# EAGLE design onion_dip_v1 (EAGLE 6.5.0)
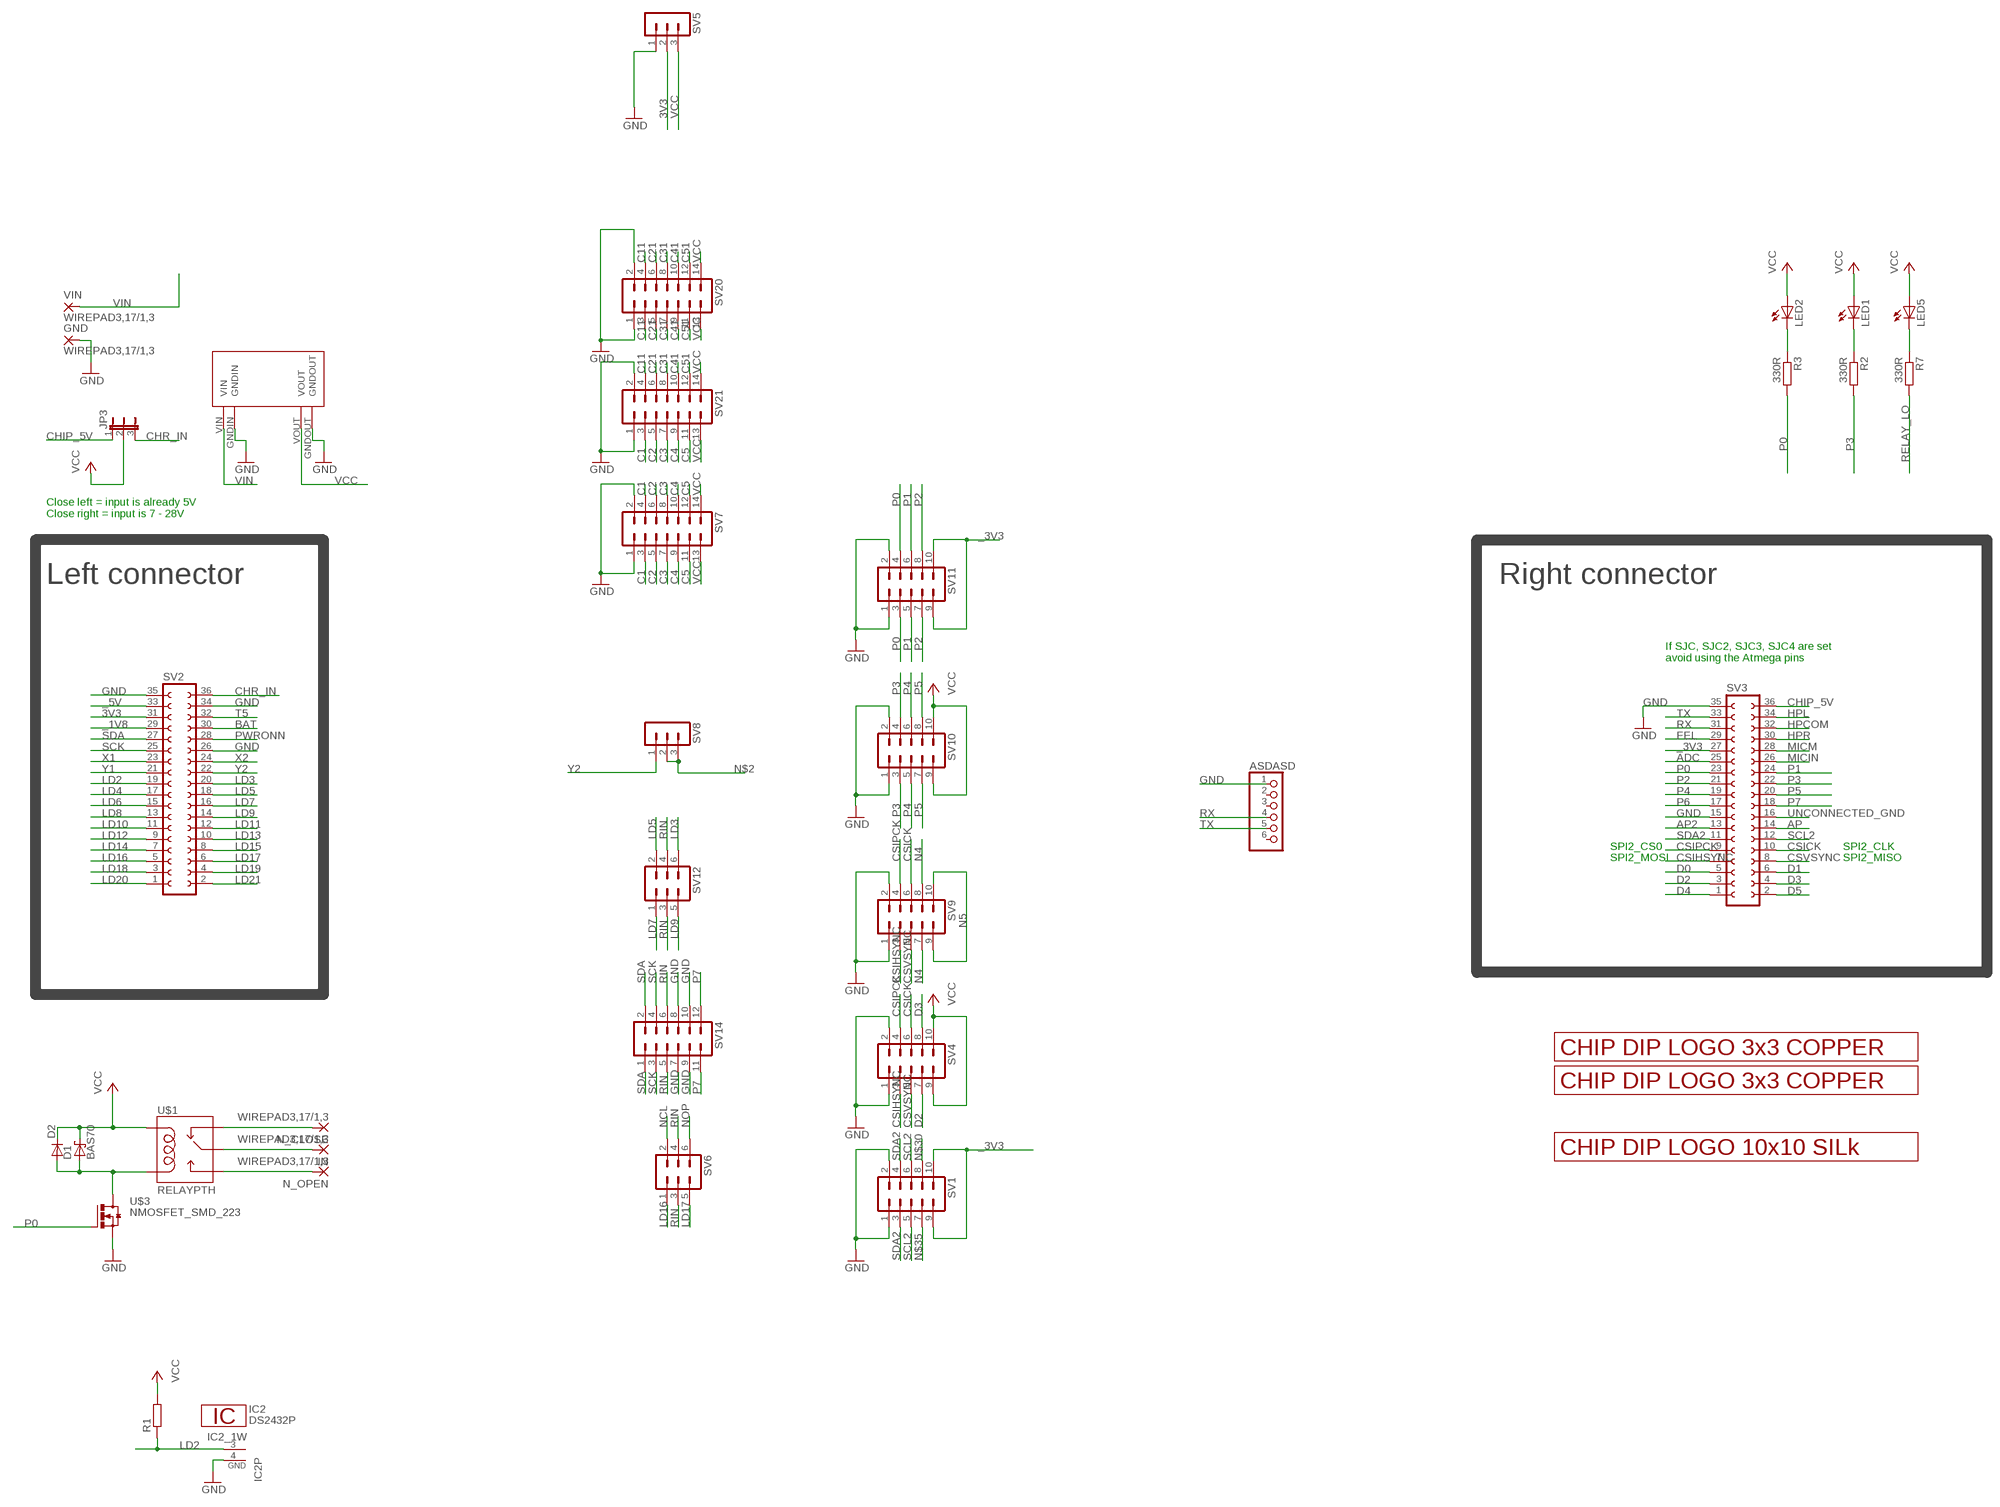
[diagram p0: schematic, sheet 1]

## Parts
ASDASD  PINHD-1X6  [1X06]
D1  BAS70  [SOT23]
D2  DIODE-SMB  [SMB]
GND  WIREPAD3,17/1,3  [3,17/1,3]
IC2  DS2432P  [TSOC6]
IN  WIREPAD3,17/1,3  [3,17/1,3]
JP3  JP2E  [JP2]
LED1  LEDCHIP-LED0805  [CHIP-LED0805]
LED2  LEDCHIP-LED0805  [CHIP-LED0805]
LED5  LEDCHIP-LED0805  [CHIP-LED0805]
N_CLOSE  WIREPAD3,17/1,3  [3,17/1,3]
N_OPEN  WIREPAD3,17/1,3  [3,17/1,3]
R1  R-EU_R0805  [R0805]
R2  330R  R-EU_R0805  [R0805]
R3  330R  R-EU_R0805  [R0805]
R7  330R  R-EU_R0805  [R0805]
SV1  MA05-2  [MA05-2]
SV2  FE18-2  [FE18-2]
SV3  FE18-2  [FE18-2]
SV4  MA05-2  [MA05-2]
SV5  MA03-1  [MA03-1]
SV6  MA03-2  [MA03-2]
SV7  MA07-2  [MA07-2]
SV8  MA03-1  [MA03-1]
SV9  MA05-2  [MA05-2]
SV10  MA05-2  [MA05-2]
SV11  MA05-2  [MA05-2]
SV12  MA03-2  [MA03-2]
SV14  MA06-2  [MA06-2]
SV20  MA07-2  [MA07-2]
SV21  MA07-2  [MA07-2]
U$1  RELAYPTH  [SRD-05VDC-SL-C]
U$3  NMOSFET_SMD_223  [SOT223]
U$4  LOGO_3X3_COPPER  [LOGO_3X3_COPPER]
U$5  LOGO_10X10_SILK  [LOGO_10X10_SILK]
U$6  LOGO_3X3_COPPER  [LOGO_3X3_COPPER]
U$9  MP1584EN_FRAMELESS  [MP1584EN_FRAMELESS]
VIN  WIREPAD3,17/1,3  [3,17/1,3]

## Nets
3V3: SV2.31 SV5.2
_1V8: SV2.29
_3V3: SV1.9 SV1.10 SV3.27 SV11.9 SV11.10
_5V: SV2.33
ADC: SV3.25
AP: SV3.14
AP2: SV3.13
BAT: SV2.30
C1: SV7.3 SV7.4 SV21.3
C2: SV7.5 SV7.6 SV21.5
C3: SV7.7 SV7.8 SV21.7
C4: SV7.9 SV7.10 SV21.9
C5: SV7.11 SV7.12 SV21.11
C11: SV20.3 SV20.4 SV21.4
C21: SV20.5 SV20.6 SV21.6
C31: SV20.7 SV20.8 SV21.8
C41: SV20.9 SV20.10 SV21.10
C51: SV20.11 SV20.12 SV21.12
CHIP_5V: JP3.1 SV3.36
CHR_IN: JP3.3 SV2.36
CSICK: SV3.10 SV4.6 SV9.6
CSIHSYNC: SV3.7 SV4.3 SV9.3
CSIPCK: SV3.9 SV4.4 SV9.4
CSVSYNC: SV3.8 SV4.5 SV9.5
D0: SV3.5
D1: SV3.6
D2: SV3.3 SV4.7
D3: SV3.4 SV4.8
D4: SV3.1
D5: SV3.2
FEL: SV3.29
GND: ASDASD.1 GND.1(P) IC2.4(GND) SV1.1 SV1.2 SV2.26 SV2.34 SV2.35 SV3.15 SV3.35 SV4.1 SV4.2 SV5.1 SV7.1 SV7.2 SV9.1 SV9.2 SV10.1 SV10.2 SV11.1 SV11.2 SV14.7 SV14.8 SV14.9 SV14.10 SV20.1 SV20.2 SV21.1 SV21.2 U$3.3(S) U$9.GNDIN U$9.GNDOUT
HPCOM: SV3.32
HPL: SV3.34
HPR: SV3.30
LD2: IC2.3(1W) R1.1 SV2.19
LD3: SV2.20 SV12.6
LD4: SV2.17
LD5: SV2.18 SV12.2
LD6: SV2.15
LD7: SV2.16 SV12.1
LD8: SV2.13
LD9: SV2.14 SV12.5
LD10: SV2.11
LD11: SV2.12
LD12: SV2.9
LD13: SV2.10
LD14: SV2.7
LD15: SV2.8
LD16: SV2.5 SV6.1
LD17: SV2.6 SV6.5
LD18: SV2.3
LD19: SV2.4
LD20: SV2.1
LD21: SV2.2
MICIN: SV3.26
MICM: SV3.28
N4: SV9.7 SV9.8
N5: SV9.9 SV9.10
N$2: SV8.2 SV8.3
N$3: LED1.C R2.1
N$4: LED2.C R3.1
N$29: LED5.C R7.1
N$30: SV1.8
N$35: SV1.7
NCL: N_CLOSE.1(P) SV6.2 U$1.SWCLOSED(SWCLOSE)
NOP: N_OPEN.1(P) SV6.6 U$1.SWOPEN
P0: R3.2 SV3.23 SV11.3 SV11.4 U$3.1(G)
P1: SV3.24 SV11.5 SV11.6
P2: SV3.21 SV11.7 SV11.8
P3: R2.2 SV3.22 SV10.3 SV10.4
P4: SV3.19 SV10.5 SV10.6
P5: SV3.20 SV10.7 SV10.8
P6: SV3.17
P7: SV3.18 SV14.11 SV14.12
PWRONN: SV2.28
RELAY_LO: D1.1(A) D2.A R7.2 U$1.COIL0 U$3.2(D) U$3.4(D)
RIN: IN.1(P) SV6.3 SV6.4 SV12.3 SV12.4 SV14.5 SV14.6 U$1.SWCOMMON
RX: ASDASD.4 SV3.31
SCK: SV2.25 SV14.3 SV14.4
SCL2: SV1.5 SV1.6 SV3.12
SDA: SV2.27 SV14.1 SV14.2
SDA2: SV1.3 SV1.4 SV3.11
T5: SV2.32
TX: ASDASD.5 SV3.33
UNCONNECTED_GND: SV3.16
VCC: D1.3(C) D2.C JP3.2 LED1.A LED2.A LED5.A R1.2 SV4.9 SV4.10 SV5.3 SV7.13 SV7.14 SV10.9 SV10.10 SV20.13 SV20.14 SV21.13 SV21.14 U$1.COIL1 U$9.VOUT
VIN: U$9.VIN VIN.1(P)
X1: SV2.23
X2: SV2.24
Y1: SV2.21
Y2: SV2.22 SV8.1
Unconnected: ASDASD.2 ASDASD.3 ASDASD.6

## Notes on the sheet
- Close left = input is already 5V
  Close right = input is 7 - 28V
- Left connector | Right connector
- If SJC, SJC2, SJC3, SJC4 are set 
  avoid using the Atmega pins
- SPI2_CS0 | SPI2_CLK
- SPI2_MOSI | SPI2_MISO

## Library data of the parts
ASDASD = pinhead:PINHD-1X6: PIN HEADER
D1 = diode:BAS70: Silicon Schottky Diodes General-purpose diode for high-speed switching
D2 = diode:DIODE-: DIODE
GND IN N_CLOSE N_OPEN VIN = wirepad:WIREPAD: Wire PAD connect wire on PCB
IC2 = 1wire:DS2432: 1024-Bit Protected EEPROM with SHA-1 Engine This chip is a cryptographic device, providing 1024 Bits of EEPROM memory which may be written only after supplying the correct 64 bit secret. the secret cannot be read back from the device. The other features of this chip are like the DS2431. Please note the SHA-1 hash algorithm is considered weak if the data is not properly "padded". If you don't understand anything of this, don't use this chip. Author: Jan Kandziora <jjj@gmx.de>
JP3 = jumper:JP2E: JUMPER
LED1 LED2 LED5 = led:LED: LED OSRAM: - CHIPLED LG R971, LG N971, LY N971, LG Q971, LY Q971, LO R971, LY R971 LH N974, LH R974 LS Q976, LO Q976, LY Q976 LO Q996 - Hyper CHIPLED LW Q18S LB Q993, LB Q99A, LB R99A - SideLED LS A670, LO A670, LY A670, LG A670, LP A670 LB A673, LV A673, LT A673, LW A673 LH A674 LY A675 LS A676, LA A676, LO A676, LY A676, LW A676 LS A679, LY A679, LG A679 - Hyper Micro SIDELED® LS Y876, LA Y876, LO Y876, LY Y876 LT Y87S - SmartLED LW L88C, LW L88S LB L89C, LB L89S, LG L890 LS L89K, LO L89K, LY L89K LS L896, LA L896, LO L896, LY L896 - TOPLED LS T670, LO T670, LY T670, LG T670, LP T670 LSG T670, LSP T670, LSY T670, LOP T670, LYG T670 LG T671, LOG T671, LSG T671 LB T673, LV T673, LT T673, LW T673 LH T674 LS T676, LA T676, LO T676, LY T676, LB T676, LH T676, LSB T676, LW T676 LB T67C, LV T67C, LT T67C, LS T67K, LO T67K, LY T67K, LW E67C LS E67B, LA E67B, LO E67B, LY E67B, LB E67C, LV E67C, LT E67C LW T67C LS T679, LY T679, LG T679 LS T770, LO T770, LY T770, LG T770, LP T770 LB T773, LV T773, LT T773, LW T773 LH T774 LS E675, LA E675, LY E675, LS T675 LS T776, LA T776, LO T776, LY T776, LB T776 LHGB T686 LT T68C, LB T68C - Hyper Mini TOPLED® LB M676 - Mini TOPLED Santana® LG M470 LS M47K, LO M47K, LY M47K Source: http://www.osram.convergy.de LUXEON: - LUMILED® LXK2-PW12-R00, LXK2-PW12-S00, LXK2-PW14-U00, LXK2-PW14-V00 LXK2-PM12-R00, LXK2-PM12-S00, LXK2-PM14-U00 LXK2-PE12-Q00, LXK2-PE12-R00, LXK2-PE12-S00, LXK2-PE14-T00, LXK2-PE14-U00 LXK2-PB12-K00, LXK2-PB12-L00, LXK2-PB12-M00, LXK2-PB14-N00, LXK2-PB14-P00, LXK2-PB14-Q00 LXK2-PR12-L00, LXK2-PR12-M00, LXK2-PR14-Q00, LXK2-PR14-R00 LXK2-PD12-Q00, LXK2-PD12-R00, LXK2-PD12-S00 LXK2-PH12-R00, LXK2-PH12-S00 LXK2-PL12-P00, LXK2-PL12-Q00, LXK2-PL12-R00 Source: www.luxeon.com KINGBRIGHT: KA-3528ASYC Source: www.kingbright.com
R1-R3 R7 = rcl:R-EU_: RESISTOR, European symbol
SV1 SV4 SV9-SV11 = con-lstb_no_frame:MA05-2: PIN HEADER; OC_FARNELL: unknown; OC_NEWARK: unknown
SV2 SV3 = con-lsta:FE18-2: FEMALE HEADER; OC_FARNELL: unknown; OC_NEWARK: unknown
SV5 SV8 = con-lstb_no_frame:MA03-1: PIN HEADER; OC_FARNELL: unknown; OC_NEWARK: unknown
SV6 SV12 = con-lstb_no_frame:MA03-2: PIN HEADER; OC_FARNELL: unknown; OC_NEWARK: unknown
SV7 SV20 SV21 = con-lstb_no_frame:MA07-2: PIN HEADER; OC_FARNELL: unknown; OC_NEWARK: unknown
SV14 = con-lstb_no_frame:MA06-2: PIN HEADER; OC_FARNELL: unknown; OC_NEWARK: unknown
U$1 = SRD-05VDC-SL-C:RELAY: SPDT relay (COM-00101)
U$3 = transistor-power:NMOSFET_SMD_223
U$4 U$6 = logo:LOGO_3X3_COPPER
U$5 = logo:LOGO_10X10_SILK
U$9 = power_supply:MP1584EN_FRAMELESS

## Board
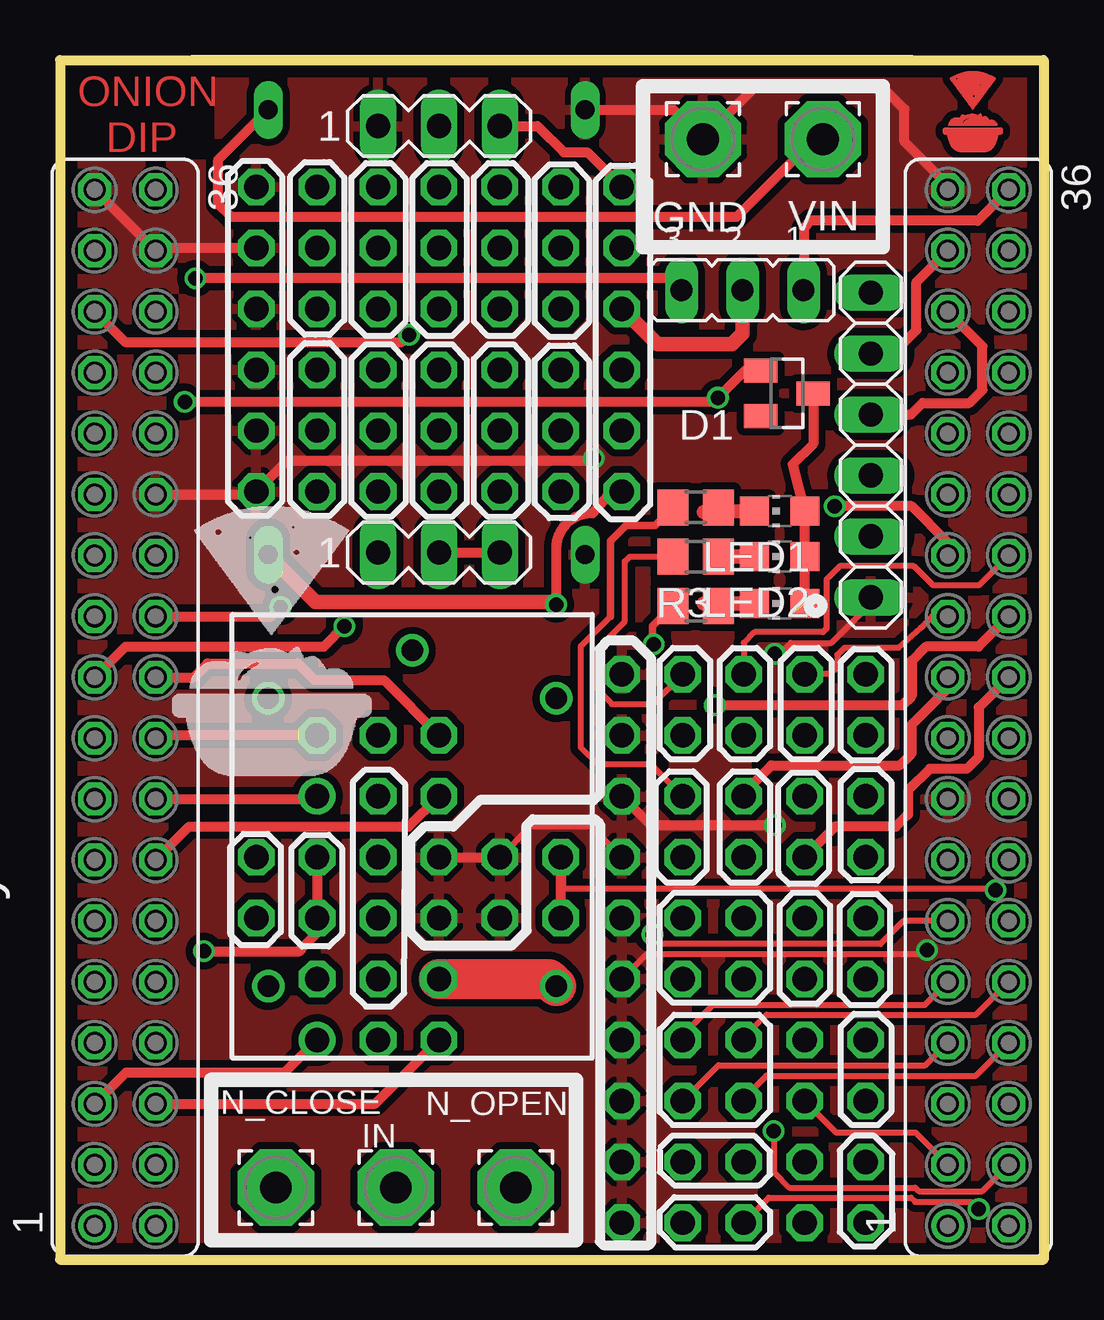
[diagram p1: board, top side]
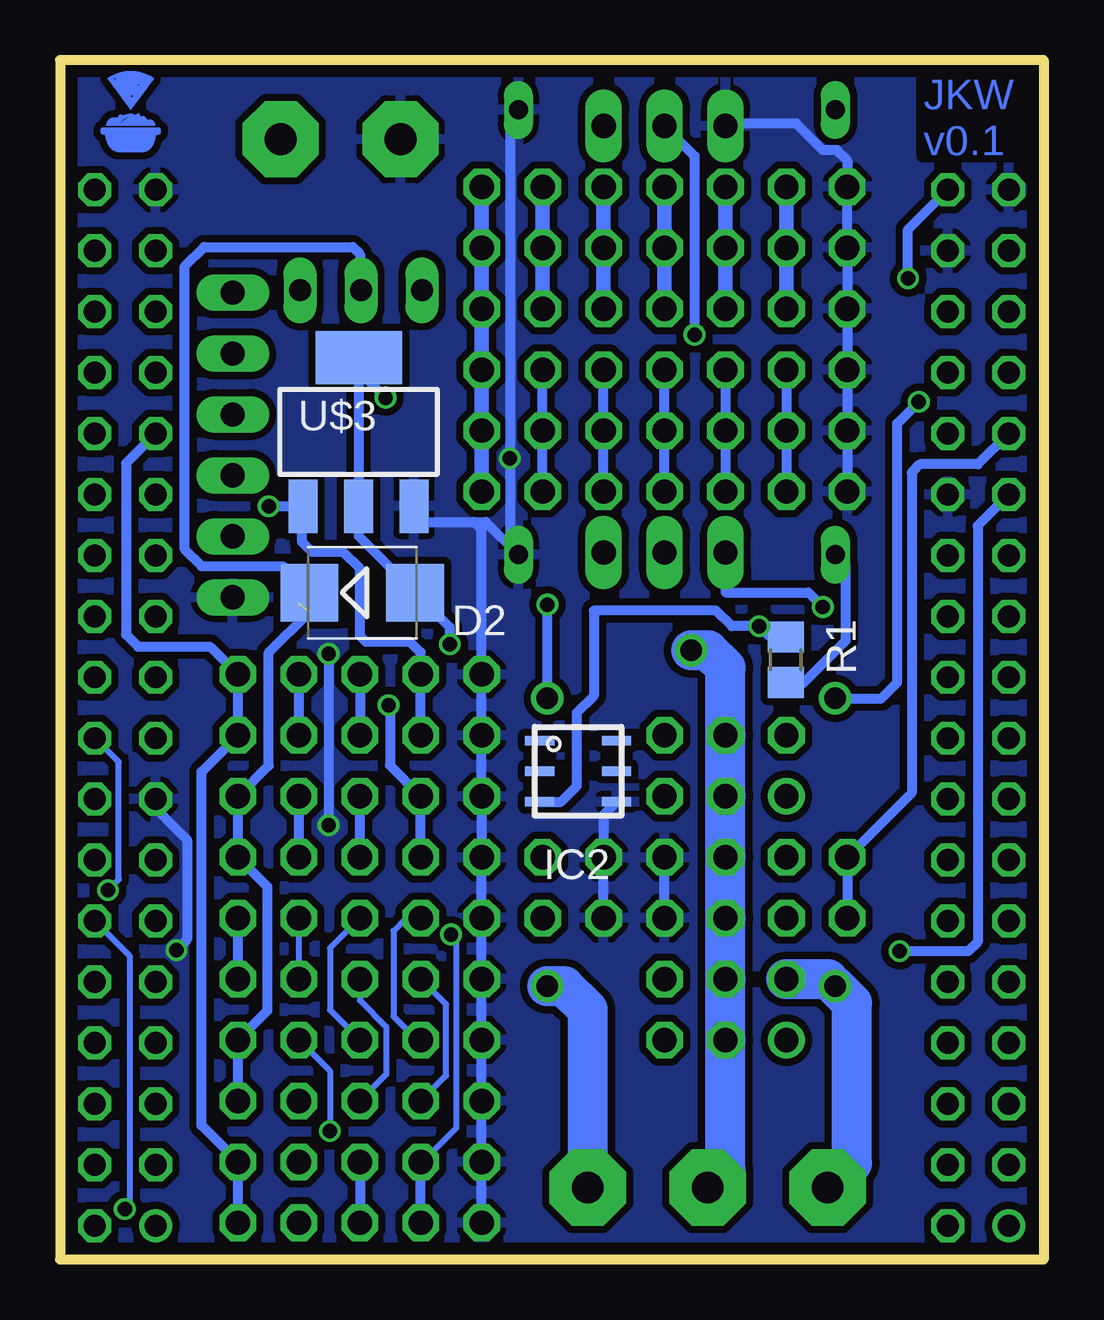
[diagram p2: board, bottom side, seen from below]

Size 41 x 50 mm. Coordinates in mm from the lower left corner, seen from the top.
Outline: 0,50 41,50 41,0 0,0 0,50
Copper layers (1*16): Top 0.035mm / dielectric 1.6mm / Bottom 0.035mm
Design rules "Elecrow_2-layer_PCB_eagle_rule": minimum track width 6mil, minimum drill 12mil, track to track 6mil, track to pad 6mil, pad to pad 6mil, via to via 8mil, smd to smd 0mil, copper to edge 20mil, drill to drill 10mil, minimum pad ring 6mil, minimum via ring 6mil, stop-mask expansion 0mil, vias tented up to drill 100mil, thermal gap 10mil

### Footprints (pad centres in the part's own frame; a part is rotated, then mirrored left to right if it is on the bottom)
1X06 = drill 1.016 long: 1 -6.35,0; 2 -3.81,0; 3 -1.27,0; 4 1.27,0; 5 3.81,0; 6 6.35,0
SOT23 = smd 1 x 1.4: 1 -0.95,-1.1; 2 0.95,-1.1; 3 0,1.1
SMB = smd 2.4 x 2.4: A 2.2,0; C -2.2,0
3,17/1,3 = drill 1.321 pad 3.175 octagon: 1 0,0
TSOC6 = smd 0.406 x 1.219: 1 -1.27,-1.6; 2 0,-1.6; 3 1.27,-1.6; 4 1.27,1.6; 5 0,1.6; 6 -1.27,1.6
JP2 = drill 0.914 long: 1 -2.54,0; 2 0,0; 3 2.54,0
CHIP-LED0805 = smd 1.2 x 1.2: A 0,-1.05; C 0,1.05
R0805 = smd 1.3 x 1.5: 1 -0.95,0; 2 0.95,0
MA05-2 = drill 1.016 octagon: 1 -5.08,-1.27; 2 -5.08,1.27; 3 -2.54,-1.27; 4 -2.54,1.27; 5 0,-1.27; 6 0,1.27; 7 2.54,-1.27; 8 2.54,1.27; 9 5.08,-1.27; 10 5.08,1.27
FE18-2 = drill 0.914: 1 -21.59,1.27 | drill 0.914 octagon: 2 -21.59,-1.27; 3 -19.05,1.27; 4 -19.05,-1.27; 5 -16.51,1.27; 6 -16.51,-1.27; 7 -13.97,1.27; 8 -13.97,-1.27; 9 -11.43,1.27; 10 -11.43,-1.27; 11 -8.89,1.27; 12 -8.89,-1.27; 13 -6.35,1.27; 14 -6.35,-1.27; 15 -3.81,1.27; 16 -3.81,-1.27; 17 -1.27,1.27; 18 -1.27,-1.27; 19 1.27,1.27; 20 1.27,-1.27; 21 3.81,1.27; 22 3.81,-1.27; 23 6.35,1.27; 24 6.35,-1.27; 25 8.89,1.27; 26 8.89,-1.27; 27 11.43,1.27; 28 11.43,-1.27; 29 13.97,1.27; 30 13.97,-1.27; 31 16.51,1.27; 32 16.51,-1.27; 33 19.05,1.27; 34 19.05,-1.27; 35 21.59,1.27; 36 21.59,-1.27
MA03-1 = drill 1.016 long: 1 -2.54,0; 2 0,0; 3 2.54,0
MA03-2 = drill 1.016: 1 -2.54,-1.27 | drill 1.016 octagon: 2 -2.54,1.27; 3 0,-1.27; 4 0,1.27; 5 2.54,-1.27; 6 2.54,1.27
MA07-2 = drill 1.016 octagon: 1 -7.62,-1.27; 2 -7.62,1.27; 3 -5.08,-1.27; 4 -5.08,1.27; 5 -2.54,-1.27; 6 -2.54,1.27; 7 0,-1.27; 8 0,1.27; 9 2.54,-1.27; 10 2.54,1.27; 11 5.08,-1.27; 12 5.08,1.27; 13 7.62,-1.27; 14 7.62,1.27
MA06-2 = drill 1.016 octagon: 1 -6.35,-1.27; 2 -6.35,1.27; 3 -3.81,-1.27; 4 -3.81,1.27; 5 -1.27,-1.27; 6 -1.27,1.27; 7 1.27,-1.27; 8 1.27,1.27; 9 3.81,-1.27; 10 3.81,1.27; 11 6.35,-1.27; 12 6.35,1.27
SRD-05VDC-SL-C = drill 0.9: COIL0 -5.39,-6.12; COIL1 -5.39,5.88; SWCLOSED 6.61,-6.12; SWCOMMON -7.39,-0.12; SWOPEN 6.61,5.88
SOT223 = smd 1.219 x 2.235: 1 -2.311,-3.099; 2 0,-3.099; 3 2.311,-3.099 | smd 3.6 x 2.2: 4 0,3.099
MP1584EN_FRAMELESS = drill 0.8 long: GNDIN 1.778,14.986; GNDOUT 20.32,14.986; VIN 1.778,1.778; VOUT 20.32,1.778

### Placement (x,y rotation side)
ASDASD  33.8,33.95 90 top
D1  30.3,36.1 270 top
D2  28.4,27.8 0 bottom
GND  26.8,46.7 180 top
IC2  19.4,20.35 270 bottom
IN  14,3 0 top
JP3  28.45,40.4 180 top
LED1  30,31.2 90 top
LED2  30,29.3 90 top
LED5  30,27.35 90 top
N_CLOSE  9,3 0 top
N_OPEN  19,3 0 top
R1  10.75,25 270 bottom
R2  26.5,31.35 180 top
R3  26.5,29.3 180 top
R7  26.5,27.25 180 top
SV1  28.5,2.8 0 top
SV2  2.72,23 90 top
SV3  38.28,23 90 top
SV4  28.5,7.88 0 top
SV5  15.8,47.25 0 top
SV6  13.26,10.42 0 top
SV7  15.8,33.28 0 top
SV8  15.8,29.47 0 top
SV9  28.5,12.96 0 top
SV10  28.5,18.04 0 top
SV11  28.5,23.12 0 top
SV12  13.26,20.58 0 top
SV14  14.53,15.5 0 top
SV20  15.8,43.44 0 top
SV21  15.8,38.36 0 top
U$1  14.8,18 270 top
U$3  28.55,34.5 0 bottom
U$4  38.05,47.85 0 top
U$5  4.65,20.15 0 top
U$6  38.05,47.85 0 bottom
U$9  6.9,49.7 270 top
VIN  31.8,46.7 180 top

### Tracks (layer width: path | path; a pad name or v marks a point on that pad's centre or on a via)
3V3  (via drill 0.6)
  Top 0.406: SV2.31 2.71,38.25 14.25,38.25 v14.55,38.55
  Bottom 0.406: SV5.2 14.55,46 v14.55,38.55
_3V3
  Bottom 0.406: SV1.9 SV1.10 35.1,5.59 35.1,20.33 SV11.9 SV11.10 34.74,25.55 37.75,25.55 38.25,26.05 38.25,33.19 SV3.27
C1
  Bottom 0.406: SV21.3 SV7.4 SV7.3
C2
  Bottom 0.406: SV21.5 SV7.6 SV7.5
C3
  Bottom 0.406: SV7.7 SV7.8 SV21.7
C4
  Bottom 0.406: SV7.9 SV7.10 SV21.9
C5
  Bottom 0.406: SV7.11 SV7.12 SV21.11
C11
  Bottom 0.61: SV20.4 SV20.3 SV21.4
C21
  Bottom 0.61: SV21.6 SV20.5 SV20.6
C31
  Bottom 0.61: SV20.8 SV20.7 SV21.8
C41
  Bottom 0.61: SV21.10 SV20.9 SV20.10
C51
  Bottom 0.61: SV20.12 SV20.11 SV21.12
CHIP_5V
  Top 0.406: SV3.36 38.26,43.3 31.3,43.3 31,43 31,40.21 JP3.1
CHR_IN  (via drill 0.6)
  Top 0.406: JP3.3 25.41,40.9 v5.65,40.9
  Bottom 0.406: v5.65,40.9 5.65,42.93 SV2.36
CSICK
  Top 0.254: SV4.6 28.5,9.25 29.45,10.2 38.18,10.2 SV3.10
  Bottom 0.254: SV9.6 29.75,12.98 29.75,10.4 SV4.6
CSIHSYNC
  Top 0.254: SV4.3 27.45,8.1 36.08,8.1 SV3.7
  Bottom 0.254: SV9.3 24.9,10.63 24.9,7.67 SV4.3
CSIPCK
  Top 0.254: SV4.4 25.96,9.36 27.21,10.61 36.05,10.61 SV3.9
  Bottom 0.254: 26.42,14.23 SV9.4 26.57,14.23 27.1,13.7 27.1,10.14 26.11,9.15 SV4.4
CSVSYNC
  Top 0.254: SV3.8 38.18,7.66 29.44,7.66 28.5,6.72 SV4.5
  Bottom 0.254: SV9.5 28.5,10.8 27.4,9.7 27.4,7.71 SV4.5
D2
  Top 0.254: SV4.7 32.35,5.3 35.66,5.3 SV3.3
D3  (via drill 0.6)
  Top 0.254: v29.75,5.35 29.75,3.65 30.4,3 35.65,3 35.8,2.85 38.45,2.85 SV3.4
  Bottom 0.254: SV4.8 29.75,7.86 v29.75,5.35
GND  (via drill 0.6)
  Top 0.254: v36.15,12.9 35.99,12.74 24.47,12.74 SV9.1 | SV10.1 22.14,18.05 19.62,18.05 SV14.10 | v29.8,25.25 30,25.25 30.45,25.7 32.15,25.7 33.8,27.35 ASDASD.1
  Top 0.406: U$9.GNDIN 25.58,47.92 GND.1 28.9,48.8 34.35,48.8 35.2,47.95 35.2,46.6 37.01,44.79 SV3.35 | SV2.35 SV2.34 4.11,42.17 SV20.1 | SV14.8 SV14.10 | v29.8,18.1 24.63,18.1 SV10.2 | SV2.26 8.06,31.89 SV7.1 9.47,33.3 22.15,33.3 v22.25,33.4
  Bottom 0.406: SV1.1 SV1.2 SV4.1 SV4.2 SV9.1 SV9.2 SV10.1 SV10.2 SV11.1 SV11.2 23.42,30.42 23.75,30.75 | SV3.15 37.01,18.81 35.7,17.5 35.7,13.35 v36.15,12.9 | SV14.7 SV14.8 | SV14.9 SV14.10 18.34,18.54 IC2.4 | U$3.3 26.24,31.29 25.7,30.75 23.75,30.75 | 23.75,30.75 23.26,30.75 U$9.GNDOUT 22.25,29.74 v22.25,33.4 22.25,47.56 U$9.GNDIN | v29.8,25.25 v29.8,18.1 | SV5.1 13.16,47.35 10.3,47.35 9.2,46.25 8.61,46.25 8.18,45.82 SV20.2 SV20.1 SV21.2 SV21.1 SV7.2 SV7.1
  pour Top (isolate 0.305, rank 2): -0.07,0.25 40.88,0.25 41.01,10.57 41.01,50.01 0,50.01 0,10.47
  pour Bottom (isolate 0.305): 0,50 41.05,50 41.05,0.25 0.02,0.25 0.02,49.92
LD2  (via drill 0.6)
  Top 0.406: SV2.19 2.73,25.55 11,25.55 v11.85,26.4
  Bottom 0.406: R1.1 11.4,25.95 v11.85,26.4 13,26.4 13.65,27.05 18.75,27.05 18.75,23.5 19.45,22.8 19.45,19.75 20.12,19.08 IC2.3
LD3
  Top 0.406: SV2.20 5.57,24.27 6.15,24.85 9.9,24.85 10.6,24.15 13.5,24.15 SV12.6
LD5
  Top 0.406: SV12.2 4.11,21.85 SV2.18
LD7
  Top 0.406: SV2.16 10.6,19.19 SV12.1
LD9
  Top 0.406: SV2.14 5.39,18.05 14.54,18.05 SV12.5
LD16
  Top 0.406: SV2.5 2.76,7.8 9.37,7.8 SV6.1
LD17
  Top 0.406: SV2.6 13.14,6.49 SV6.5
N4
  Bottom 0.254: SV9.7 SV9.8
N5
  Bottom 0.406: SV9.9 SV9.10
N$2
  Top 0.406: SV8.2 SV8.3
N$3
  Top 0.61: LED1.C 26.85,31.15 R2.1
N$4
  Top 0.61: LED2.C R3.1
N$29
  Top 0.61: LED5.C 26.85,27.35 R7.1
NCL
  Bottom 0.406: 8.98,11.69 U$1.SWCLOSED
  Bottom 1.676: N_CLOSE.1 7.98,4.02 7.98,10.69 U$1.SWCLOSED | SV6.2 8.98,11.69
NOP
  Top 1.676: SV6.6 20.38,11.69 U$1.SWOPEN
  Bottom 1.676: N_OPEN.1 19,10.41 19.98,11.39 U$1.SWOPEN
P0  (via drill 0.6)
  Top 0.254: SV11.4 24.72,23.15 23,23.15 22.2,23.95 22.2,25.25 23.55,26.6 23.55,29.1 23.75,29.3 R3.2
  Top 0.406: SV3.23 37.01,29.89 35.5,31.4 v32.3,31.4
  Bottom 0.406: SV11.3 SV11.4 25.96,25.31 26.4,25.75 28.25,25.75 28.5,26 28.5,28.8 29.2,29.5 30.5,29.5 30.9,29.9 30.9,31.36 U$3.1 | v32.3,31.4 U$3.1 | U$3.1
P1
  Top 0.254: SV3.24 38.3,28.1 36.4,28.1 35.6,28.9 32.5,28.9 31.95,28.35 31.95,26.3 31.8,26.15 28.95,26.15 28.5,25.7 28.5,23.9
  Top 0.406: 28.5,23.9 SV11.6
  Bottom 0.406: SV11.6 SV11.5
P2
  Top 0.254: SV3.21 36.36,26.81 35.88,26.32 34.95,25.5 32.7,25.5 32.4,25.2 32.4,24.7 32.1,24.4 SV11.8
  Bottom 0.406: SV11.7 SV11.8
P3  (via drill 0.6)
  Top 0.254: 22.95,26.8 21.7,25.55 21.7,21.35 22.4,20.65 24.62,20.65 SV10.4
  Top 0.305: 22.95,26.8 22.95,29.95 23.6,30.6 24.8,30.6 R2.2
  Top 0.406: SV3.22 38.29,25.55 36.1,25.55 35.5,24.95 35.5,23.5 35.1,23.1 v27.3,23.1
  Top 0.61: R2.2 25.6,31.4
  Bottom 0.406: v27.3,23.1 27.25,23.05 27.25,20.6 SV10.4 SV10.3
P4
  Top 0.406: SV10.6 28.5,19.45 29.65,20.6 35,20.6 35.5,21.1 35.5,22.3 37.01,23.81 SV3.19
  Bottom 0.406: SV10.5 SV10.6
P5
  Top 0.406: SV3.20 38.3,23.02 38.3,20.95 37.8,20.45 36.25,20.45 35.35,19.55 35.35,18.55 34.85,18.05 32.32,18.05 SV10.7
  Bottom 0.406: SV10.7 SV10.8
P7  (via drill 0.6)
  Top 0.254: v39,15.4 38.95,15.45 21,15.45 20.9,15.55
  Top 0.406: 20.9,15.55 20.9,16.75 SV14.12 SV14.11
  Bottom 0.254: v39,15.4 38.55,15.85 38.55,20.73 SV3.18
RELAY_LO  (via drill 0.6)
  Top 0.254: 24.7,25.7 v24.75,25.65
  Top 0.305: 24.7,25.7 24.7,26.4 R7.2
  Top 0.406: 27.5,36 v27.43,35.92 | v27.43,35.92 27.25,35.75 v5.2,35.75 | D1.1 28.55,37.05 v27.43,35.92
  Bottom 0.406: v27.43,35.92 28.55,37.05 U$3.4 U$3.2 28.55,30.15 D2.A 24.75,26.35 v24.75,25.65 | U$1.COIL0 6.76,23.39 6.1,24.05 6.1,34.85 v5.2,35.75
RIN
  Bottom 1.676: IN.1 13.26,3.74 SV6.3 SV6.4 SV14.5 SV14.6 SV12.3 SV12.4 13.26,24.67 13.98,25.39 U$1.SWCOMMON
RX
  Top 0.406: ASDASD.4 35.47,35.22 35.95,35.7 37.9,35.7 38.45,36.25 38.45,38.07 SV3.31
SCK  (via drill 0.6)
  Top 0.406: SV14.4 SV14.3 10.7,14.21 10.7,13.6 10.05,12.95 arc-90 9.95,12.85 v6,12.85
  Bottom 0.406: SV2.25 2.75,30.59 2.75,13.25 3.15,12.85 v6,12.85
SCL2  (via drill 0.6)
  Top 0.254: SV1.5 29.55,2.58 35.47,2.58 35.65,2.4 38,2.4 v38.3,2.1
  Bottom 0.254: SV3.12 38.1,12.66 38.1,2.3 v38.3,2.1
  Bottom 0.406: SV1.6 SV1.5
SDA
  Bottom 0.406: SV14.1 SV14.2 5.5,19.45 5.5,32.8 5.15,33.15 2.73,33.15 SV2.27
SDA2  (via drill 0.6)
  Top 0.254: SV3.11 35.16,14.11 34.2,13.15 25.1,13.15 v24.7,13.55
  Bottom 0.254: SV1.4 25.88,4.07 24.47,5.48 24.47,13.32 v24.7,13.55
  Bottom 0.406: SV1.3 SV1.4
TX
  Top 0.406: ASDASD.5 34.71,37.76 35.7,38.75 35.7,40.74 SV3.33
VCC  (via drill 0.6)  (1 unrouted)
  Top 0.406: LED5.A LED2.A LED1.A 30.55,33.15 31.4,34 D1.3 | SV5.3 19.9,47.25 21,46.15 21.98,46.15 SV20.14 | SV7.13 23.01,32.01 22.2,31.1 arc90 20.68,29.68 v20.68,27.3
  Top 0.61: U$9.VOUT 10.66,27.4 20.58,27.4 v20.68,27.3 | JP3.2 28.45,38.6 28,38.15 24.9,38.15 SV21.14
  Bottom 0.406: SV4.9 SV4.10 32.35,10.38 32.35,15.54 SV10.9 SV10.10 32.3,20.59 32.3,25.3 30.6,27 D2.C 31.7,28.9 35.1,28.9 35.8,29.6 35.8,41.4 35,42.2 28.8,42.2 28.5,41.9 28.5,40.45 JP3.2 | SV20.14 23.42,43.58 | R1.2 10,24.05 8.25,25.8 8.25,28.95 U$9.VOUT | U$1.COIL1 v20.68,27.3
  Bottom 0.61: SV20.14 SV20.13 SV21.14 SV21.13 SV7.14 | 23.42,34.17 SV7.14 | SV7.14 SV7.13
VIN
  Top 0.406: VIN.1 31.45,46.7 28.2,43.45 7.15,43.45 6.6,44 6.6,45.84 U$9.VIN
Y2  (via drill 0.6)
  Top 0.406: SV2.22 8.81,26.81 v9.2,27.2
  Bottom 0.406: v9.2,27.2 9.81,27.81 13.26,27.81 SV8.1

### Text on the board
Top: ONION / DIP
Bottom: JKW / v0.1
tNames: not yet ordered